# Altium project ControlBoard.PrjPcb (part 6 of 8)
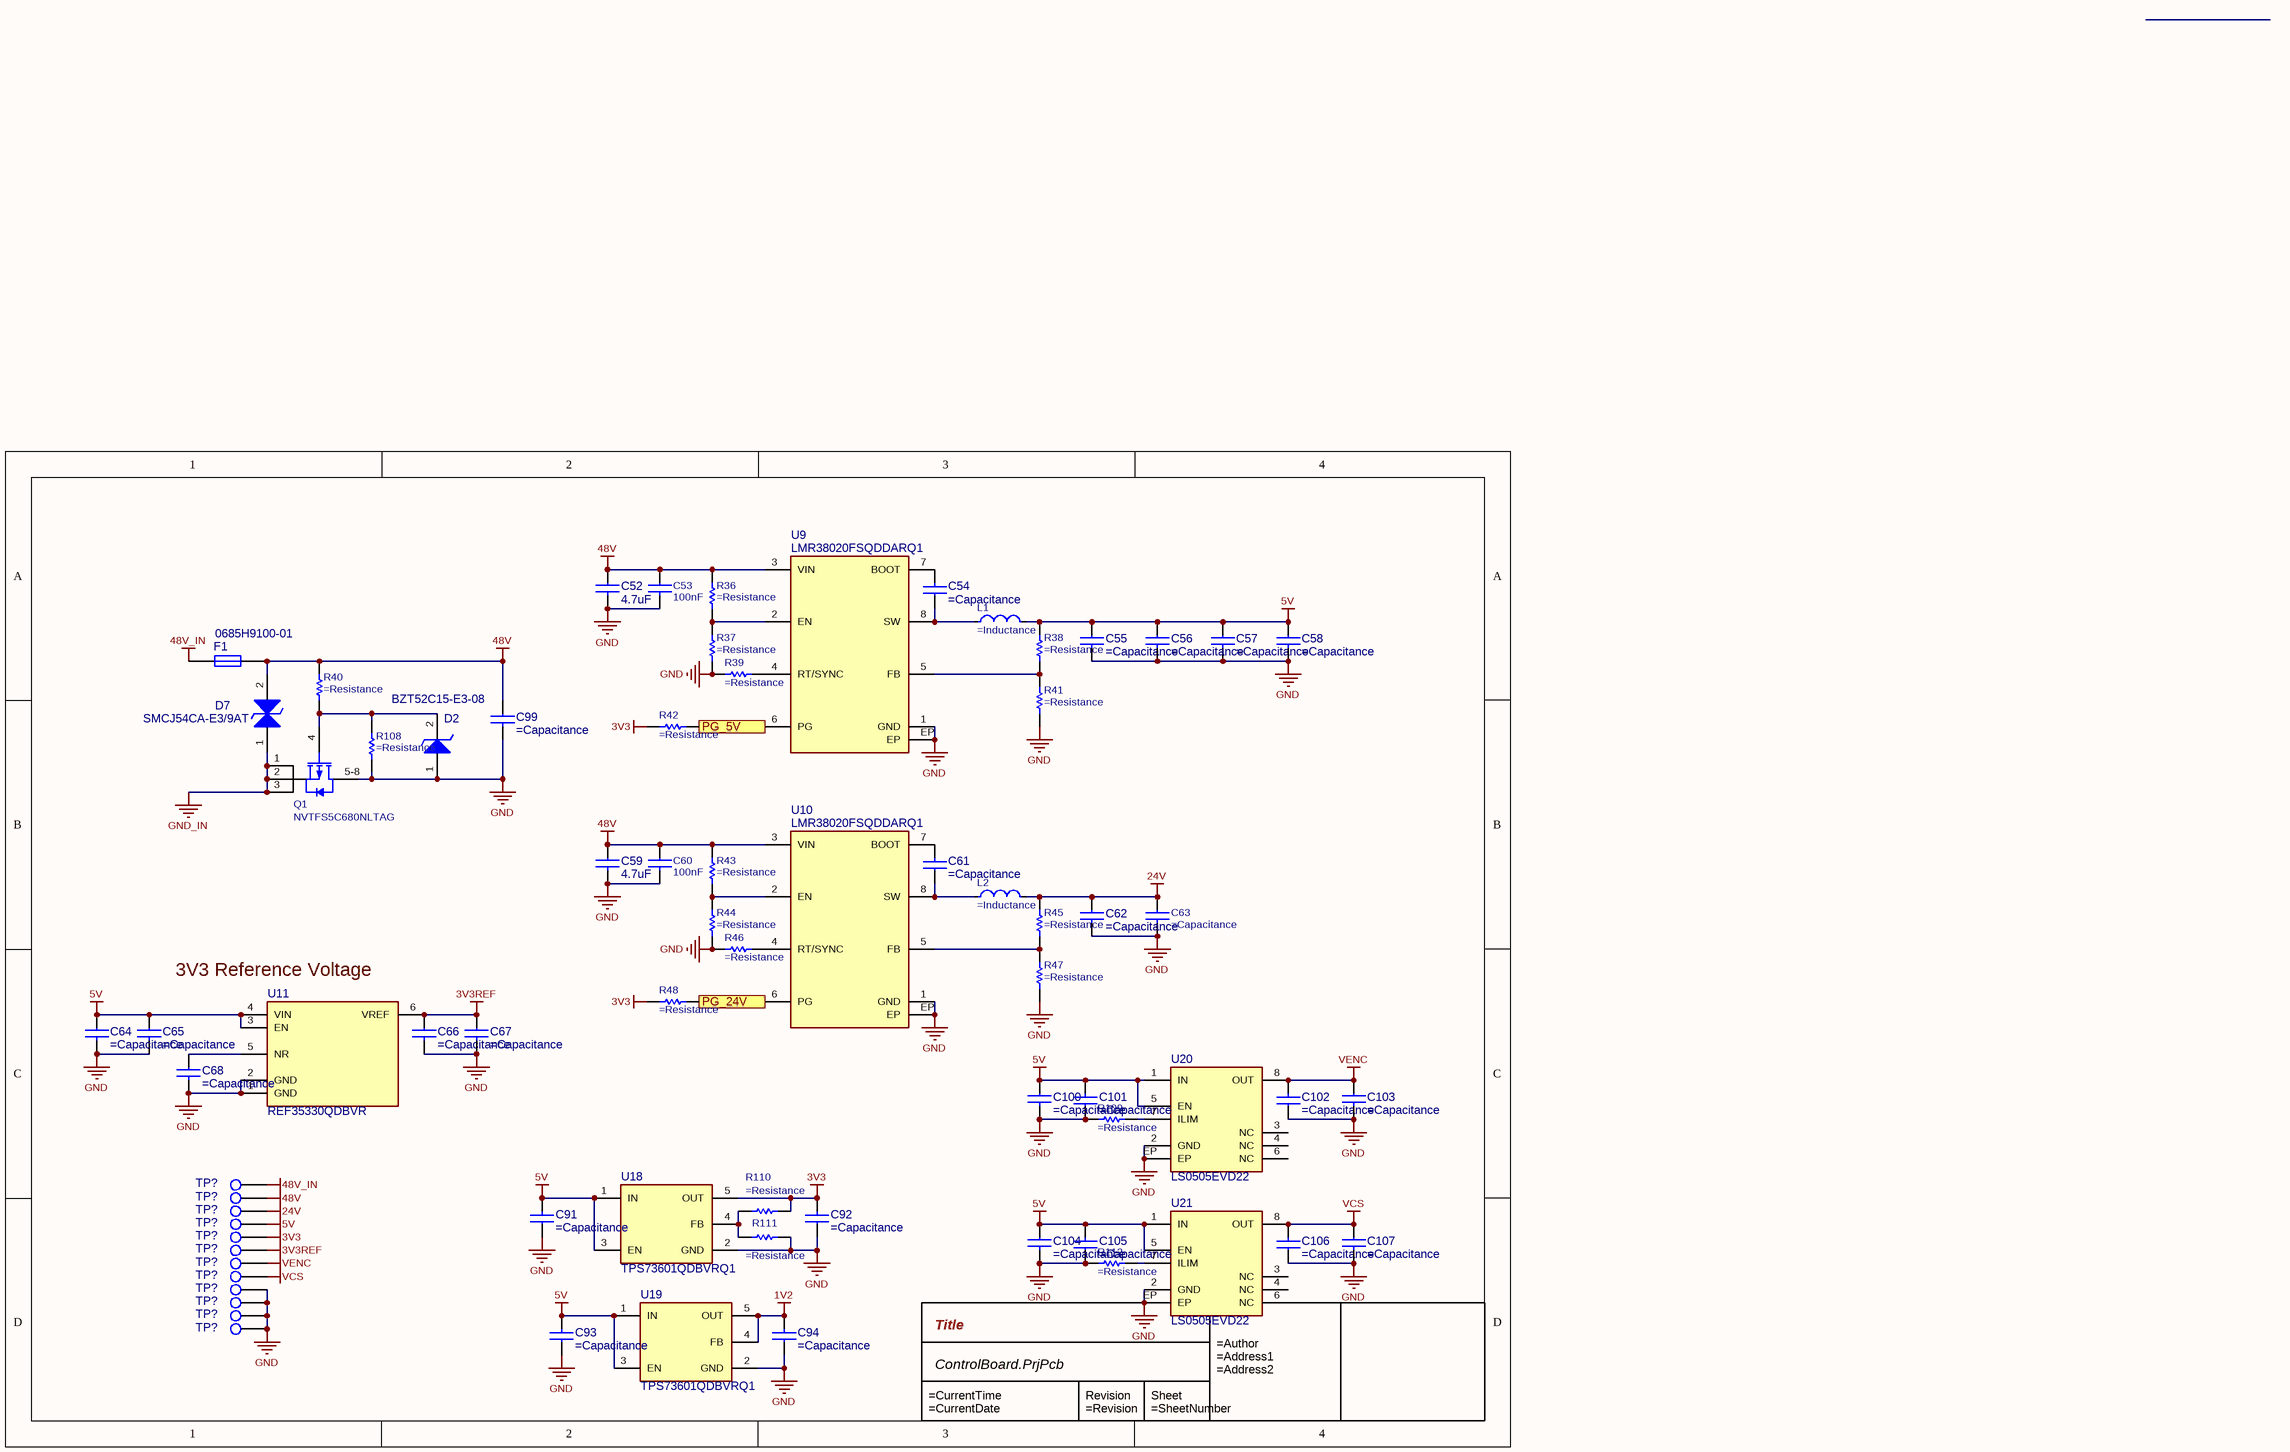
[diagram p17: Supply.SchDoc]

## Sheet Supply.SchDoc: Title (continued)
### Library data of the parts
C52 C59 = CAP1206-4.7uF-100V: Ceramic Capacitor, Multilayer, Ceramic, 100V, 10% +Tol, 10% -Tol, X7S, +-22% TC, 4.7uF, Surface Mount, 1206 inch; Manufacturer: Samsung Electro-Mechanics; Manufacturer Part Number: CL31Y475KCK6PNE; Supplier 1: DigiKey; Supplier Part Number 1: 1276-CL31Y475KCK6PNECT-ND; Supplier: DigiKey; Supplier Part Number: 1276-CL31Y475KCK6PNECT-ND; Category: Ceramic Capacitors; Stock: 182; Pricing: 1=0,85, 10=0,537, 50=0,4144, 100=0,3767, 500=0,31288, 1000=0,29316 (USD); Capacitance: 4.7uF
C53 C60 = CAP0603-0.1uF-100V: CAP CER 0.1UF 100V X7R 0603; Manufacturer: Yageo; Manufacturer Part Number: CC0603KRX7R0BB104; Material: 4241ConductorMaterial; Tolerance: 10%; Capacitance: 100nF; Supplier: Digikey; Supplier Part Number: 311-1523-1-ND; RoHS: Yes; Category: Ceramic Capacitors; Stock: 3495882; Pricing: 1=0,14, 10=0,079, 100=0,0484, 1000=0,0325 (USD); Mounting Technology: Surface Mount; Case/Package: 0603; Case Code (Metric): 1608; Case Code (Imperial): 0603; Weight: 7.1E-05oz; Min Operating Temperature: -55°C; Max Operating Temperature: 125°C; Value: 100nF; Voltage Rating: 100V; Packaging: Tape and Reel; Dielectric: X7R; Termination: SMD/SMT; Voltage Rating (DC): 100V; Package Quantity: 4000; Series: CC; Length: 0.063inch; Width: 0.031inch; Height: 900um; Thickness: 0.035inch; Lead Free: 5697LeadFree; RoHS Compliant: Yes; ComponentLink1URL: https://datasheet.ciiva.com/6277/mlccorderingcode-6277082.pdf?src-supplier=Digikey; ComponentLink1Description: https://datasheet.ciiva.com/6277/mlccorderingcode-6277082.pdf?src-supplier=Digikey; ComponentLink2URL: https://datasheet.ciiva.com/6277/mlccorderingcode-6277081.pdf?src-supplier=Digikey; ComponentLink2Description: https://datasheet.ciiva.com/6277/mlccorderingcode-6277081.pdf?src-supplier=Digikey; ComponentLink3URL: https://datasheet.ciiva.com/6277/mlccorderingcode-6277030.pdf?src-supplier=Digikey; ComponentLink3Description: https://datasheet.ciiva.com/6277/mlccorderingcode-6277030.pdf?src-supplier=Digikey; Supplier 1: Digikey; Supplier Part Number 1: 311-1523-1-ND
C54 C61 C91-C94 C101 C102 C105 C106 = CAP0402-0.1uF-50V: CAP CER 0.1UF 50V X7R 0402; Manufacturer: Walsin Technologies; Manufacturer Part Number: 0402B104K500CT; Capacitance: 100nF; Material: 4241ConductorMaterial; Value: 100nF; Tolerance: 10%; Dielectric: 1511DielectricType; Supplier: Digikey; Supplier Part Number: 1292-1176-1-ND; RoHS: Yes; Category: Ceramic Capacitors; Stock: 109567; Pricing: 1=0,08, 10=0,005, 100=0,0032, 1000=0,0024 (USD); Mounting Technology: Surface Mount; Case/Package: 0402; Case Code (Imperial): 0402; Case Code (Metric): 1005; Min Operating Temperature: -55°C; Max Operating Temperature: 125°C; Packaging: Cut Tape; Voltage Rating: 50V; Series: -; Voltage Rating (DC): 50V; Height: 550um; RoHS Compliant: Yes; Lead Free: 5697LeadFree; ComponentLink1URL: http://datasheet.octopart.com/0402B104K500CT-Walsin-Technologies-datasheet-26371553.pdf?src-supplier=Arrow+Electronics; ComponentLink1Description: http://datasheet.octopart.com/0402B104K500CT-Walsin-Technologies-datasheet-26371553.pdf?src-supplier=Arrow+Electronics; ComponentLink2URL: http://datasheet.octopart.com/0402B104K500CT-Walsin-Technologies-datasheet-26371553.pdf?src-supplier=Verical; ComponentLink2Description: http://datasheet.octopart.com/0402B104K500CT-Walsin-Technologies-datasheet-26371553.pdf?src-supplier=Verical; ComponentLink3URL: http://www.passivecomponent.com/indexsea/0402B104K500CT-IE.pdf?src-supplier=Digikey; ComponentLink3Description: http://www.passivecomponent.com/indexsea/0402B104K500CT-IE.pdf?src-supplier=Digikey; ComponentLink4URL: http://datasheet.octopart.com/0402B104K500CT-Walsin-Technologies-datasheet-26371553.pdf?src-supplier=Rs; ComponentLink4Description: http://datasheet.octopart.com/0402B104K500CT-Walsin-Technologies-datasheet-26371553.pdf?src-supplier=Rs; ComponentLink5URL: https://datasheet.octopart.com/0402B104K500CT-Walsin-Technologies-datasheet-128065749.pdf?src-supplier=Future+Electronics; ComponentLink5Description: https://datasheet.octopart.com/0402B104K500CT-Walsin-Technologies-datasheet-128065749.pdf?src-supplier=Future+Electronics; ComponentLink6URL: http://datasheet.octopart.com/0402B104K500CT-Walsin-Technologies-datasheet-26371553.pdf?src-supplier=Farnell; ComponentLink6Description: http://datasheet.octopart.com/0402B104K500CT-Walsin-Technologies-datasheet-26371553.pdf?src-supplier=Farnell; ComponentLink7URL: http://datasheet.octopart.com/0402B104K500CT-Walsin-Technologies-datasheet-26371553.pdf?src-supplier=Newark; ComponentLink7Description: http://datasheet.octopart.com/0402B104K500CT-Walsin-Technologies-datasheet-26371553.pdf?src-supplier=Newark; ComponentLink8URL: http://datasheet.octopart.com/0402B104K500CT-Walsin-Technologies-datasheet-26371553.pdf?src-supplier=Mouser; ComponentLink8Description: http://datasheet.octopart.com/0402B104K500CT-Walsin-Technologies-datasheet-26371553.pdf?src-supplier=Mouser; ComponentLink9URL: http://datasheet.octopart.com/0402B104K500CT-Walsin-Technologies-datasheet-26371553.pdf?src-supplier=Digikey; ComponentLink9Description: http://datasheet.octopart.com/0402B104K500CT-Walsin-Technologies-datasheet-26371553.pdf?src-supplier=Digikey; ComponentLink10URL: https://datasheet.octopart.com/0402B104K500CT-Walsin-Technologies-datasheet-62066062.pdf?src-supplier=TME; ComponentLink10Description: https://datasheet.octopart.com/0402B104K500CT-Walsin-Technologies-datasheet-62066062.pdf?src-supplier=TME; ComponentLink11URL: http://datasheet.octopart.com/0402B104K500CT-Walsin-Technologies-datasheet-26371553.pdf?src-supplier=Freelance+Electronics; ComponentLink11Description: http://datasheet.octopart.com/0402B104K500CT-Walsin-Technologies-datasheet-26371553.pdf?src-supplier=Freelance+Electronics; ComponentLink12URL: http://datasheet.octopart.com/0402B104K500CT-Walsin-Technologies-datasheet-26371553.pdf?src-supplier=Component+Sense; ComponentLink12Description: http://datasheet.octopart.com/0402B104K500CT-Walsin-Technologies-datasheet-26371553.pdf?src-supplier=Component+Sense; ComponentLink13URL: http://datasheet.octopart.com/0402B104K500CT-Walsin-Technologies-datasheet-26371553.pdf?src-supplier=NAC+Semi; ComponentLink13Description: http://datasheet.octopart.com/0402B104K500CT-Walsin-Technologies-datasheet-26371553.pdf?src-supplier=NAC+Semi; ComponentLink14URL: https://datasheet.octopart.com/0402B104K500CT-Walsin-Technologies-datasheet-136037192.pdf?src-supplier=TECHDesign; ComponentLink14Description: https://datasheet.octopart.com/0402B104K500CT-Walsin-Technologies-datasheet-136037192.pdf?src-supplier=TECHDesign; Supplier 1: Digikey; Supplier Part Number 1: 1292-1176-1-ND
C55 C62 C65 C66 C68 = CAP0402-0.1uF-50V: Multilayer Ceramic Capacitors MLCC - SMD/SMT 50V 1000pF C0G 0402 2%; Manufacturer: Walsin Technologies; Manufacturer Part Number: 0402B104K500CT; Capacitance: 100nF; Material: 4241ConductorMaterial; Value: 100nF; Tolerance: 10%; Dielectric: 1511DielectricType; Supplier: Digikey; Supplier Part Number: 1292-1176-1-ND; RoHS: Yes; Category: Ceramic Capacitors; Stock: 109567; Pricing: 1=0,08, 10=0,005, 100=0,0032, 1000=0,0024 (USD); Mounting Technology: Surface Mount; Case/Package: 0402; Case Code (Imperial): 0402; Case Code (Metric): 1005; Min Operating Temperature: -55°C; Max Operating Temperature: 125°C; Packaging: Cut Tape; Voltage Rating: 50V; Series: -; Voltage Rating (DC): 50V; Height: 550um; RoHS Compliant: Yes; Lead Free: 5697LeadFree; ComponentLink1URL: http://datasheet.octopart.com/0402B104K500CT-Walsin-Technologies-datasheet-26371553.pdf?src-supplier=Arrow+Electronics; ComponentLink1Description: http://datasheet.octopart.com/0402B104K500CT-Walsin-Technologies-datasheet-26371553.pdf?src-supplier=Arrow+Electronics; ComponentLink2URL: http://datasheet.octopart.com/0402B104K500CT-Walsin-Technologies-datasheet-26371553.pdf?src-supplier=Verical; ComponentLink2Description: http://datasheet.octopart.com/0402B104K500CT-Walsin-Technologies-datasheet-26371553.pdf?src-supplier=Verical; ComponentLink3URL: http://www.passivecomponent.com/indexsea/0402B104K500CT-IE.pdf?src-supplier=Digikey; ComponentLink3Description: http://www.passivecomponent.com/indexsea/0402B104K500CT-IE.pdf?src-supplier=Digikey; ComponentLink4URL: http://datasheet.octopart.com/0402B104K500CT-Walsin-Technologies-datasheet-26371553.pdf?src-supplier=Rs; ComponentLink4Description: http://datasheet.octopart.com/0402B104K500CT-Walsin-Technologies-datasheet-26371553.pdf?src-supplier=Rs; ComponentLink5URL: https://datasheet.octopart.com/0402B104K500CT-Walsin-Technologies-datasheet-128065749.pdf?src-supplier=Future+Electronics; ComponentLink5Description: https://datasheet.octopart.com/0402B104K500CT-Walsin-Technologies-datasheet-128065749.pdf?src-supplier=Future+Electronics; ComponentLink6URL: http://datasheet.octopart.com/0402B104K500CT-Walsin-Technologies-datasheet-26371553.pdf?src-supplier=Farnell; ComponentLink6Description: http://datasheet.octopart.com/0402B104K500CT-Walsin-Technologies-datasheet-26371553.pdf?src-supplier=Farnell; ComponentLink7URL: http://datasheet.octopart.com/0402B104K500CT-Walsin-Technologies-datasheet-26371553.pdf?src-supplier=Newark; ComponentLink7Description: http://datasheet.octopart.com/0402B104K500CT-Walsin-Technologies-datasheet-26371553.pdf?src-supplier=Newark; ComponentLink8URL: http://datasheet.octopart.com/0402B104K500CT-Walsin-Technologies-datasheet-26371553.pdf?src-supplier=Mouser; ComponentLink8Description: http://datasheet.octopart.com/0402B104K500CT-Walsin-Technologies-datasheet-26371553.pdf?src-supplier=Mouser; ComponentLink9URL: http://datasheet.octopart.com/0402B104K500CT-Walsin-Technologies-datasheet-26371553.pdf?src-supplier=Digikey; ComponentLink9Description: http://datasheet.octopart.com/0402B104K500CT-Walsin-Technologies-datasheet-26371553.pdf?src-supplier=Digikey; ComponentLink10URL: https://datasheet.octopart.com/0402B104K500CT-Walsin-Technologies-datasheet-62066062.pdf?src-supplier=TME; ComponentLink10Description: https://datasheet.octopart.com/0402B104K500CT-Walsin-Technologies-datasheet-62066062.pdf?src-supplier=TME; ComponentLink11URL: http://datasheet.octopart.com/0402B104K500CT-Walsin-Technologies-datasheet-26371553.pdf?src-supplier=Freelance+Electronics; ComponentLink11Description: http://datasheet.octopart.com/0402B104K500CT-Walsin-Technologies-datasheet-26371553.pdf?src-supplier=Freelance+Electronics; ComponentLink12URL: http://datasheet.octopart.com/0402B104K500CT-Walsin-Technologies-datasheet-26371553.pdf?src-supplier=Component+Sense; ComponentLink12Description: http://datasheet.octopart.com/0402B104K500CT-Walsin-Technologies-datasheet-26371553.pdf?src-supplier=Component+Sense; ComponentLink13URL: http://datasheet.octopart.com/0402B104K500CT-Walsin-Technologies-datasheet-26371553.pdf?src-supplier=NAC+Semi; ComponentLink13Description: http://datasheet.octopart.com/0402B104K500CT-Walsin-Technologies-datasheet-26371553.pdf?src-supplier=NAC+Semi; ComponentLink14URL: https://datasheet.octopart.com/0402B104K500CT-Walsin-Technologies-datasheet-136037192.pdf?src-supplier=TECHDesign; ComponentLink14Description: https://datasheet.octopart.com/0402B104K500CT-Walsin-Technologies-datasheet-136037192.pdf?src-supplier=TECHDesign; Supplier 1: Digikey; Supplier Part Number 1: 1292-1176-1-ND; China RoHS: Compliant; Depth: 500µm; Dielectric Material: Ceramic; Length: 1mm; Lifecycle Status: Production; Pins: 2; Number of Terminals: 2; REACH SVHC: Yes; Termination: SMD/SMT; Thickness: 558.8µm; Width: 500µm; ComponentLink15URL: https://datasheet.octopart.com:443/C0402C102G5GACTU-KEMET-datasheet-178132257.pdf?src-supplier=IHS; ComponentLink15Description: https://datasheet.octopart.com:443/C0402C102G5GACTU-KEMET-datasheet-178132257.pdf?src-supplier=IHS; ComponentLink16URL: https://datasheet.octopart.com:443/C0402C102G5GAC7867-KEMET-datasheet-10540709.pdf?src-supplier=IHS; ComponentLink16Description: https://datasheet.octopart.com:443/C0402C102G5GAC7867-KEMET-datasheet-10540709.pdf?src-supplier=IHS; ComponentLink17URL: https://datasheet.octopart.com:443/C0402C102G5GACTU-KEMET-datasheet-137357759.pdf?src-supplier=Upverter; ComponentLink17Description: https://datasheet.octopart.com:443/C0402C102G5GACTU-KEMET-datasheet-137357759.pdf?src-supplier=Upverter; ComponentLink18URL: https://datasheet.octopart.com:443/C0402C102G5GACTU-KEMET-datasheet-149521574.pdf?src-supplier=Farnell; ComponentLink18Description: https://datasheet.octopart.com:443/C0402C102G5GACTU-KEMET-datasheet-149521574.pdf?src-supplier=Farnell; ComponentLink19URL: https://datasheet.octopart.com:443/C0402C102G5GACTU-KEMET-datasheet-102158736.pdf?src-supplier=Newark; ComponentLink19Description: https://datasheet.octopart.com:443/C0402C102G5GACTU-KEMET-datasheet-102158736.pdf?src-supplier=Newark; ComponentLink20URL: https://datasheet.octopart.com:443/C0402C102G5GACTU-KEMET-datasheet-68331921.pdf?src-supplier=element14+APAC; ComponentLink20Description: https://datasheet.octopart.com:443/C0402C102G5GACTU-KEMET-datasheet-68331921.pdf?src-supplier=element14+APAC; ComponentLink21URL: https://datasheet.octopart.com:443/C0402C102G5GACTU-KEMET-datasheet-178087919.pdf?src-supplier=element14+APAC; ComponentLink21Description: https://datasheet.octopart.com:443/C0402C102G5GACTU-KEMET-datasheet-178087919.pdf?src-supplier=element14+APAC; ComponentLink22URL: https://datasheet.octopart.com:443/C0402C102G5GACTU-KEMET-datasheet-157246123.pdf?src-supplier=Electro+Sonic; ComponentLink22Description: https://datasheet.octopart.com:443/C0402C102G5GACTU-KEMET-datasheet-157246123.pdf?src-supplier=Electro+Sonic; ComponentLink23URL: https://datasheet.octopart.com/C0402C102G5GACTU-KEMET-datasheet-84169754.pdf; ComponentLink23Description: https://datasheet.octopart.com/C0402C102G5GACTU-KEMET-datasheet-84169754.pdf; ComponentLink24URL: https://datasheet.octopart.com:443/C0402C102G5GACTU-Kemet-datasheet-11974058.pdf?src-supplier=Arrow+Electronics; ComponentLink24Description: https://datasheet.octopart.com:443/C0402C102G5GACTU-Kemet-datasheet-11974058.pdf?src-supplier=Arrow+Electronics
C56-C58 = CAP0402-22uF-10V: Ceramic Capacitor, Multilayer, Ceramic, 10V, 20% +Tol, 20% -Tol, X6S, 22uF, Surface Mount, 0603; Manufacturer: Murata; Manufacturer Part Number: GRM188C81A226ME01D; Capacitance: 22µF; Value: 22µF; Supplier 1: DigiKey; Supplier Part Number 1: 490-GRM188C81A226ME01DTR-ND; Supplier: DigiKey; Supplier Part Number: 490-GRM188C81A226ME01DTR-ND; RoHS: Compliant; Category: Ceramic Capacitors; Pricing: 4000=0,07397 (USD); Case/Package: 0603; Dielectric: X6S; Dielectric Material: Ceramic; Height: 800µm; Length: 1.6mm; Lifecycle Status: Production; Material: Ceramic; Max Operating Temperature: 105°C; Min Operating Temperature: -55°C; Mounting Technology: Surface Mount; Number of Terminals: 2; REACH SVHC: Yes; Thickness: 800µm; Tolerance: 20%; Voltage Rating: 10V; Voltage Rating (DC): 10V; Width: 800µm; ComponentLink1URL: https://datasheet.octopart.com:443/GRM188C81A226ME01D-Murata-datasheet-165579666.pdf?src-supplier=TME; ComponentLink1Description: https://datasheet.octopart.com:443/GRM188C81A226ME01D-Murata-datasheet-165579666.pdf?src-supplier=TME; ComponentLink2URL: https://datasheet.octopart.com/GRM188C81A226ME01D-Murata-datasheet-12515295.pdf; ComponentLink2Description: https://datasheet.octopart.com/GRM188C81A226ME01D-Murata-datasheet-12515295.pdf; ComponentLink3URL: https://datasheet.octopart.com/GRM188C81A226ME01D-Murata-datasheet-12510076.pdf; ComponentLink3Description: https://datasheet.octopart.com/GRM188C81A226ME01D-Murata-datasheet-12510076.pdf; ComponentLink4URL: https://datasheet.octopart.com/GRM188C81A226ME01D-Murata-datasheet-11978611.pdf; ComponentLink4Description: https://datasheet.octopart.com/GRM188C81A226ME01D-Murata-datasheet-11978611.pdf; ComponentLink5URL: https://datasheet.octopart.com/GRM188C81A226ME01D-Murata-datasheet-10025737.pdf; ComponentLink5Description: https://datasheet.octopart.com/GRM188C81A226ME01D-Murata-datasheet-10025737.pdf; ComponentLink6URL: https://datasheet.octopart.com/GRM188C81A226ME01D-Murata-datasheet-8819587.pdf; ComponentLink6Description: https://datasheet.octopart.com/GRM188C81A226ME01D-Murata-datasheet-8819587.pdf; ComponentLink7URL: http://sigma.octopart.com:80/reach_statement/Murata-company-16.pdf?src-supplier=Compliance+Statements; ComponentLink7Description: http://sigma.octopart.com:80/reach_statement/Murata-company-16.pdf?src-supplier=Compliance+Statements
C63 = CAP0805-33uF-10V: CAP CER 22UF 50V X5R SMD; Manufacturer: TDK; Manufacturer Part Number: C2012X5R1A336M125AC; Capacitance: 33uF; Dielectric Material: Ceramic; Material: 4241ConductorMaterial; Value: 33uF; Voltage Rating: 10V; Tolerance: 20%; Supplier: Digikey; Supplier Part Number: 445-8238-1-ND; RoHS: Yes; Category: Ceramic Capacitors; Stock: 98304; Pricing: 1=0,89, 10=0,565, 100=0,3979, 1000=0,31083 (USD); Mounting Technology: Surface Mount; Case/Package: 0805; Case Code (Metric): 2012; Case Code (Imperial): 0805; Weight: 0.000194oz; Min Operating Temperature: -55°C; Max Operating Temperature: 85°C; Packaging: Tape and Reel; Series: C; Package Quantity: 1; Voltage Rating (DC): 10V; Termination: SMD/SMT; Dielectric: X5R; Length: 2mm; Width: 0.049inch; Height: 1.25mm; Depth: 1.25mm; Thickness: 0.057inch; RoHS Compliant: Yes; Lead Free: Lead Free; Reach SVHC Compliant: No; ComponentLink1URL: https://datasheet.ciiva.com/24216/c2012x5r1a336m125ac-264804-24216541.pdf?src-supplier=Mouser; ComponentLink1Description: https://datasheet.ciiva.com/24216/c2012x5r1a336m125ac-264804-24216541.pdf?src-supplier=Mouser; ComponentLink2URL: https://datasheet.ciiva.com/6259/tdkmlcccaprange-6259263.pdf?src-supplier=Digikey; ComponentLink2Description: https://datasheet.ciiva.com/6259/tdkmlcccaprange-6259263.pdf?src-supplier=Digikey; Supplier 1: Digikey; Supplier Part Number 1: 445-1655-1-ND
C64 C67 = CAP0402-4.7uF-10V: Ceramic Capacitor, Ceramic, 10V, 10% +Tol, 10% -Tol, X5R, 15% TC, 4.7uF, Surface Mount, 0402; Manufacturer: Yageo Group; Manufacturer Part Number: CC0402KRX5R6BB475; Capacitance: 4.7µF; Value: 4.7µF; Temperature Coefficient: 30ppm/°C; Supplier 1: DigiKey; Supplier Part Number 1: 13-CC0402KRX5R6BB475DKR-ND; Supplier: DigiKey; Supplier Part Number: 13-CC0402KRX5R6BB475DKR-ND; RoHS: Compliant; Category: Ceramic Capacitors; Pricing: 1=0,11, 10=0,063, 50=0,0438, 100=0,038, 500=0,02808, 1000=0,02628, 2500=0,02393, 5000=0,02325 (USD); Case/Package: 0402; China RoHS: Compliant; Dielectric: X5R; Dielectric Material: Ceramic; Halogen Free: Halogen Free; Height: 500µm; Lead Free: Lead Free; Length: 1mm; Lifecycle Status: Production; Material: Ceramic; Max Operating Temperature: 85°C; Min Operating Temperature: -55°C; Mounting Technology: Surface Mount; Number of Terminals: 2; REACH SVHC: Yes; Voltage Rating: 10V; Voltage Rating (DC): 10V; Width: 500µm; ComponentLink1URL: https://datasheet.octopart.com:443/CC0402KRX5R6BB475-Yageo-datasheet-170350636.pdf?src-supplier=Future+Electronics; ComponentLink1Description: https://datasheet.octopart.com:443/CC0402KRX5R6BB475-Yageo-datasheet-170350636.pdf?src-supplier=Future+Electronics; ComponentLink2URL: https://datasheet.octopart.com:443/CC0402KRX5R6BB475-Yageo-datasheet-82528541.pdf?src-supplier=Future+Electronics; ComponentLink2Description: https://datasheet.octopart.com:443/CC0402KRX5R6BB475-Yageo-datasheet-82528541.pdf?src-supplier=Future+Electronics; ComponentLink3URL: https://datasheet.octopart.com:443/CC0402KRX5R6BB475-Yageo-datasheet-78855684.pdf?src-supplier=Upverter; ComponentLink3Description: https://datasheet.octopart.com:443/CC0402KRX5R6BB475-Yageo-datasheet-78855684.pdf?src-supplier=Upverter; ComponentLink4URL: https://datasheet.octopart.com:443/CC0402KRX5R6BB475-Yageo-Group-datasheet-189192896.pdf?src-supplier=TME; ComponentLink4Description: https://datasheet.octopart.com:443/CC0402KRX5R6BB475-Yageo-Group-datasheet-189192896.pdf?src-supplier=TME; ComponentLink5URL: https://datasheet.octopart.com:443/CC0402KRX5R6BB475-Yageo-datasheet-182029407.pdf?src-supplier=Newark; ComponentLink5Description: https://datasheet.octopart.com:443/CC0402KRX5R6BB475-Yageo-datasheet-182029407.pdf?src-supplier=Newark; ComponentLink6URL: https://datasheet.octopart.com:443/CC0402KRX5R6BB475-Yageo-datasheet-158238148.pdf?src-supplier=Newark; ComponentLink6Description: https://datasheet.octopart.com:443/CC0402KRX5R6BB475-Yageo-datasheet-158238148.pdf?src-supplier=Newark; ComponentLink7URL: https://datasheet.octopart.com:443/CC0402KRX5R6BB475-Yageo-Group-datasheet-145016144.pdf?src-supplier=ODG+(Origin+Data+Global); ComponentLink7Description: https://datasheet.octopart.com:443/CC0402KRX5R6BB475-Yageo-Group-datasheet-145016144.pdf?src-supplier=ODG+(Origin+Data+Global); ComponentLink8URL: https://datasheet.octopart.com/CC0402KRX5R6BB475-Yageo-datasheet-86397281.pdf; ComponentLink8Description: https://datasheet.octopart.com/CC0402KRX5R6BB475-Yageo-datasheet-86397281.pdf; ComponentLink9URL: http://sigma.octopart.com:80/rohs_statement/Yageo-company-2.pdf?src-supplier=Compliance+Statements; ComponentLink9Description: http://sigma.octopart.com:80/rohs_statement/Yageo-company-2.pdf?src-supplier=Compliance+Statements; ComponentLink10URL: http://sigma.octopart.com:80/conflict_mineral_statement/Yageo-company-3.pdf?src-supplier=Compliance+Statements; ComponentLink10Description: http://sigma.octopart.com:80/conflict_mineral_statement/Yageo-company-3.pdf?src-supplier=Compliance+Statements
C99 = CAP2220-22uF-100V: 100V 22uF X7S 卤20% 2220 Multilayer Ceramic Capacitors MLCC - SMD/SMT ROHS; Manufacturer: TDK; Manufacturer Part Number: C5750X7S2A226M280KB; Manufacturer Lifecycle Status: PRODUCTION; Capacitance: 22µF; Value: 22µF; Supplier 1: DigiKey; Supplier Part Number 1: 445-C5750X7S2A226M280KBCT-ND; Supplier: DigiKey; Supplier Part Number: 445-C5750X7S2A226M280KBCT-ND; RoHS: Compliant; Category: Ceramic Capacitors; Stock: 105682; Pricing: 1=5,31, 10=3,608, 50=3,2764, 100=3,0974 (USD); Case/Package: 2220; China RoHS: Compliant; Dielectric Material: Ceramic; Height: 2.8mm; Length: 5.7mm; Lifecycle Status: Production; Material: Ceramic; Max Length: 6.1mm; Max Operating Temperature: 125°C; Max Width: 5.4mm; Min Length: 5.3mm; Min Operating Temperature: -55°C; Min Width: 4.6mm; Mounting Technology: Surface Mount; Number of Terminals: 2; REACH SVHC: Yes; Schedule B: 8532240020, 8532240020|8532240020|8532240020|8532240020|8532240020; Voltage Rating: 100V; Voltage Rating (DC): 100V; Width: 5mm; ComponentLink1URL: https://datasheet.octopart.com:443/C5750X7S2A226M280KB-TDK-datasheet-159617022.pdf?src-supplier=IHS; ComponentLink1Description: https://datasheet.octopart.com:443/C5750X7S2A226M280KB-TDK-datasheet-159617022.pdf?src-supplier=IHS; ComponentLink2URL: https://datasheet.octopart.com:443/C5750X7S2A226M280KB-TDK-datasheet-151546522.pdf?src-supplier=TDK; ComponentLink2Description: https://datasheet.octopart.com:443/C5750X7S2A226M280KB-TDK-datasheet-151546522.pdf?src-supplier=TDK; ComponentLink3URL: https://datasheet.octopart.com:443/C5750X7S2A226M280KB-TDK-datasheet-43914167.pdf?src-supplier=Future+Electronics; ComponentLink3Description: https://datasheet.octopart.com:443/C5750X7S2A226M280KB-TDK-datasheet-43914167.pdf?src-supplier=Future+Electronics; ComponentLink4URL: https://datasheet.octopart.com:443/C5750X7S2A226M280KB-TDK-datasheet-182135025.pdf?src-supplier=TME; ComponentLink4Description: https://datasheet.octopart.com:443/C5750X7S2A226M280KB-TDK-datasheet-182135025.pdf?src-supplier=TME
C100 C103 C104 C107 = CAP0402-1uF-25V: Multilayer Ceramic Capacitors MLCC - SMD/SMT 0402 1uF 25volts *Derate Voltage/Temp; Manufacturer: Murata; Manufacturer Part Number: GRM155C81E105KE11J; Manufacturer Lifecycle Status: IN PRODUCTION; Capacitance: 1µF; Value: 1µF; Dielectric: X6S; Tolerance: 10%; Voltage Rating: 25V; Supplier 1: DigiKey; Supplier Part Number 1: 490-GRM155C81E105KE11JCT-ND; Supplier: DigiKey; Supplier Part Number: 490-GRM155C81E105KE11JCT-ND; RoHS: Compliant; Category: Ceramic Capacitors; Stock: 78531; Pricing: 1=0,1, 10=0,043, 50=0,0294, 100=0,0253, 500=0,01832, 1000=0,01619, 2500=0,01394, 5000=0,01258 (USD); Case/Package: 0402; Case Code (Imperial): 0402; Case Code (Metric): 1005; Dielectric Material: Ceramic; Height: 500µm; Length: 1mm; Lifecycle Status: Production; Material: Ceramic; Max Operating Temperature: 105°C; Min Operating Temperature: -55°C; Mounting Technology: Surface Mount; Number of Terminals: 2; Packaging: Tape & Reel (TR); REACH SVHC: Yes; Termination: SMD/SMT; Thickness: 500µm; Voltage Rating (DC): 25V; Weight: 6.010099mg; Width: 500µm; ComponentLink1URL: https://datasheet.octopart.com:443/GRM155C81E105KE11J-Murata-datasheet-165579666.pdf?src-supplier=TME; ComponentLink1Description: https://datasheet.octopart.com:443/GRM155C81E105KE11J-Murata-datasheet-165579666.pdf?src-supplier=TME; ComponentLink2URL: https://datasheet.octopart.com:443/GRM155C81E105KE11J-Murata-datasheet-141266224.pdf?src-supplier=Ciiva; ComponentLink2Description: https://datasheet.octopart.com:443/GRM155C81E105KE11J-Murata-datasheet-141266224.pdf?src-supplier=Ciiva; ComponentLink3URL: https://datasheet.octopart.com:443/GRM155C81E105KE11J-Murata-datasheet-140688500.pdf?src-supplier=Ciiva; ComponentLink3Description: https://datasheet.octopart.com:443/GRM155C81E105KE11J-Murata-datasheet-140688500.pdf?src-supplier=Ciiva; ComponentLink4URL: https://datasheet.octopart.com:443/GRM155C81E105KE11J-Murata-datasheet-138740527.pdf?src-supplier=Ciiva; ComponentLink4Description: https://datasheet.octopart.com:443/GRM155C81E105KE11J-Murata-datasheet-138740527.pdf?src-supplier=Ciiva; ComponentLink5URL: https://datasheet.octopart.com:443/GRM155C81E105KE11J-Murata-datasheet-149522958.pdf?src-supplier=Farnell; ComponentLink5Description: https://datasheet.octopart.com:443/GRM155C81E105KE11J-Murata-datasheet-149522958.pdf?src-supplier=Farnell; ComponentLink6URL: https://datasheet.octopart.com/GRM155C81E105KE11J-Murata-datasheet-12515295.pdf; ComponentLink6Description: https://datasheet.octopart.com/GRM155C81E105KE11J-Murata-datasheet-12515295.pdf; ComponentLink7URL: https://datasheet.octopart.com/GRM155C81E105KE11J-Murata-datasheet-12510076.pdf; ComponentLink7Description: https://datasheet.octopart.com/GRM155C81E105KE11J-Murata-datasheet-12510076.pdf; ComponentLink8URL: https://datasheet.octopart.com/GRM155C81E105KE11J-Murata-datasheet-11978611.pdf; ComponentLink8Description: https://datasheet.octopart.com/GRM155C81E105KE11J-Murata-datasheet-11978611.pdf; ComponentLink9URL: https://datasheet.octopart.com/GRM155C81E105KE11J-Murata-datasheet-10025737.pdf; ComponentLink9Description: https://datasheet.octopart.com/GRM155C81E105KE11J-Murata-datasheet-10025737.pdf; ComponentLink10URL: https://datasheet.octopart.com/GRM155C81E105KE11J-Murata-datasheet-8819587.pdf; ComponentLink10Description: https://datasheet.octopart.com/GRM155C81E105KE11J-Murata-datasheet-8819587.pdf; ComponentLink11URL: https://datasheet.octopart.com/GRM155C81E105KE11J-Murata-datasheet-38882740.pdf; ComponentLink11Description: https://datasheet.octopart.com/GRM155C81E105KE11J-Murata-datasheet-38882740.pdf; ComponentLink12URL: http://sigma.octopart.com:80/reach_statement/Murata-company-16.pdf?src-supplier=Compliance+Statements; ComponentLink12Description: http://sigma.octopart.com:80/reach_statement/Murata-company-16.pdf?src-supplier=Compliance+Statements
D2 = BZT52C15-E3-08: DIODE ZENER 15V 410MW SOD123; Manufacturer: Vishay; Supplier: Digikey; Supplier Part Number: BZT52C15-E3-08GICT-ND; Manufacturer Part Number: BZT52C15-E3-08; RoHS: Yes; Category: Zener Diodes; Stock: 18922; Pricing: 1=0,15, 10=0,104, 100=0,047, 500=0,0465, 1000=0,046 (USD); ComponentLink1URL: http://www.mouser.com/ds/2/427/bzt52-106265.pdf?src-supplier=Mouser; ComponentLink1Description: http://www.mouser.com/ds/2/427/bzt52-106265.pdf?src-supplier=Mouser; ComponentLink2URL: http://www.farnell.com/datasheets/2046168.pdf?src-supplier=Farnell; ComponentLink2Description: http://www.farnell.com/datasheets/2046168.pdf?src-supplier=Farnell; ComponentLink3URL: http://www.vishay.com/docs/85760/bzt52.pdf?src-supplier=Digikey; ComponentLink3Description: http://www.vishay.com/docs/85760/bzt52.pdf?src-supplier=Digikey; ComponentLink4URL: https://www.vishay.com/docs/85760/bzt52.pdf?src-supplier=Digikey; ComponentLink4Description: https://www.vishay.com/docs/85760/bzt52.pdf?src-supplier=Digikey; ComponentLink5URL: http://www.vishay.com/docs/85760/bzt52.pdf?src-supplier=Avnet; ComponentLink5Description: http://www.vishay.com/docs/85760/bzt52.pdf?src-supplier=Avnet; ComponentLink6URL: http://www.farnell.com/datasheets/2046168.pdf?src-supplier=Element14; ComponentLink6Description: http://www.farnell.com/datasheets/2046168.pdf?src-supplier=Element14; ComponentLink7URL: https://datasheet.octopart.com/BZT52C15-E3-08-Vishay-datasheet-32036674.pdf?src-supplier=Newark; ComponentLink7Description: https://datasheet.octopart.com/BZT52C15-E3-08-Vishay-datasheet-32036674.pdf?src-supplier=Newark; ComponentLink8URL: http://www.farnell.com/datasheets/1852933.pdf?src-supplier=Newark; ComponentLink8Description: http://www.farnell.com/datasheets/1852933.pdf?src-supplier=Newark; Supplier 1: Digikey; Supplier Part Number 1: BZT52C15-E3-08GICT-ND
D7 = SMCJ54CA: Trans Voltage Suppressor Diode, 1500W, 54V V(RWM), Bidirectional, 1 Element, Silicon, DO-214AB; Manufacturer: Vishay; Breakdown Voltage: 63.15V; Clamping Voltage: 87.1V; Element Configuration: Single; Leakage Current: 1µA; Max Breakdown Voltage: 66.3V; Max Junction Temperature (Tj): 150°C; Max Power Dissipation: 6.5W; Max Surge Current: 200A; Min Breakdown Voltage: 60V; Number of Bidirectional Channels: 1; Peak Pulse Current: 17.2A; Peak Pulse Power: 1.5kW; Power Line Protection: No; Test Current: 1mA; Supplier 1: DigiKey; Supplier Part Number 1: SMCJ54CA-E3/9AT-ND; Supplier: DigiKey; Supplier Part Number: SMCJ54CA-E3/9AT-ND; Manufacturer Part Number: SMCJ54CA-E3/9AT; RoHS: Compliant; Category: TVS Diodes; Pricing: 3500=0,181, 24500=0,1805 (USD); Case/Package: SMC; China RoHS: Non-Compliant; Composition: Zener; Direction: Bidirectional; Height: 2.62mm; Lifecycle Status: Production; Max Operating Temperature: 150°C; Max Reverse Leakage Current: 1µA; Min Operating Temperature: -55°C; Mounting Technology: Surface Mount; Number of Channels: 1; Number of Elements: 1; Pins: 2; Number of Terminals: 2; Operating Supply Voltage: 54V; Polarity: Bidirectional; REACH SVHC: No; Reverse Breakdown Voltage: 60V; Reverse Standoff Voltage: 54V; ComponentLink1URL: https://datasheet.octopart.com:443/SMCJ54CA-E3-9AT-Vishay-datasheet-164762082.pdf?src-supplier=IHS; ComponentLink1Description: https://datasheet.octopart.com:443/SMCJ54CA-E3-9AT-Vishay-datasheet-164762082.pdf?src-supplier=IHS; ComponentLink2URL: https://datasheet.octopart.com:443/SMCJ54CA-E3-9AT-Vishay-Semiconductor-datasheet-138899015.pdf?src-supplier=Upverter; ComponentLink2Description: https://datasheet.octopart.com:443/SMCJ54CA-E3-9AT-Vishay-Semiconductor-datasheet-138899015.pdf?src-supplier=Upverter; ComponentLink3URL: https://sigma.octopart.com:443/138898641/technical_drawing/Vishay-Semiconductor-SMCJ54CA-E3-9AT.pdf?src-supplier=Upverter; ComponentLink3Description: https://sigma.octopart.com:443/138898641/technical_drawing/Vishay-Semiconductor-SMCJ54CA-E3-9AT.pdf?src-supplier=Upverter; ComponentLink4URL: https://datasheet.octopart.com:443/SMCJ54CA-E3/9AT-Vishay-datasheet-11546720.pdf?src-supplier=Arrow+Electronics; ComponentLink4Description: https://datasheet.octopart.com:443/SMCJ54CA-E3/9AT-Vishay-datasheet-11546720.pdf?src-supplier=Arrow+Electronics; ComponentLink5URL: http://sigma.octopart.com:80/rohs_statement/Vishay-company-15.pdf?src-supplier=Compliance+Statements; ComponentLink5Description: http://sigma.octopart.com:80/rohs_statement/Vishay-company-15.pdf?src-supplier=Compliance+Statements
F1 = 0685H9100-01: Fuse Chip Fast Acting 10A 125V SMD Solder Pad 1206 3.2 X 1.58 X 0.65mm Ceramic; Manufacturer: Bel Fuse; Time to Trip: 5s; Voltage Rating (DC): 32V; Supplier 1: DigiKey; Supplier Part Number 1: 5923-0685H9100-01CT-ND; Supplier: DigiKey; Supplier Part Number: 5923-0685H9100-01CT-ND; Manufacturer Part Number: 0685H9100-01; RoHS: Compliant; Category: Fuses; Stock: 123363; Pricing: 1=0,36, 5=0,302, 10=0,278, 50=0,2308, 100=0,213, 250=0,19152, 500=0,17666, 1000=0,16294 (USD); China RoHS: Compliant; Current Rating: 10A; Height: 650µm; Length: 3.2mm; Lifecycle Status: Production; Max Operating Temperature: 125°C; Min Operating Temperature: -55°C; Mounting Technology: Surface Mount; REACH SVHC: Yes; Schedule B: 8536100040, 8536100040|8536100040|8536100040|8536100040|8536100040; Voltage Rating (AC): 125V; ComponentLink1URL: https://datasheet.octopart.com:443/0685H9100-01-Bel-Fuse-datasheet-137317061.pdf?src-supplier=IHS; ComponentLink1Description: https://datasheet.octopart.com:443/0685H9100-01-Bel-Fuse-datasheet-137317061.pdf?src-supplier=IHS; ComponentLink2URL: https://datasheet.octopart.com:443/0685H9100-01-Bel-Fuse-datasheet-104408181.pdf?src-supplier=element14+APAC; ComponentLink2Description: https://datasheet.octopart.com:443/0685H9100-01-Bel-Fuse-datasheet-104408181.pdf?src-supplier=element14+APAC
L1 = ETQP4M150KFM: Power Inductor, 15Uh, Shielded, 7.2A Rohs Compliant: Yes |Panasonic ETQP4M150KFM; DC Resistance (DCR): 66.77mΩ; Value: 15µH; Max Current Rating: 4.6A; Number of Circuits: 1; Test Frequency: 100kHz; Tolerance: 20%; Supplier 1: DigiKey; Supplier Part Number 1: 10-ETQ-P4M150KFMCT-ND; Supplier: DigiKey; Supplier Part Number: 10-ETQ-P4M150KFMCT-ND; Manufacturer: Panasonic; Manufacturer Part Number: ETQP4M150KFM; RoHS: Compliant; Category: Fixed Inductors; Stock: 1970; Pricing: 1=0,76, 10=0,623, 25=0,5768, 50=0,5438, 100=0,5126, 250=0,47424 (USD); Height: 4.8mm; Lifecycle Status: Production; Max Operating Temperature: 150°C; Min Operating Temperature: -40°C; Number of Terminals: 2; REACH SVHC: Yes; Shielding: Yes; Width: 7mm; ComponentLink1URL: https://datasheet.octopart.com:443/ETQP4M150KFM-Panasonic-datasheet-180975443.pdf?src-supplier=IHS; ComponentLink1Description: https://datasheet.octopart.com:443/ETQP4M150KFM-Panasonic-datasheet-180975443.pdf?src-supplier=IHS; Inductance: 15µH
L2 = ETQP5M470YFM: Power Choke Shielded Wirewound 48uH 20% 100KHz Metal 2.9A 0.172Ohm DCR Automotive T/R; Manufacturer: Panasonic; Core Material: Composite, Metal; Current: 19A; DC Resistance (DCR): 172mΩ; Value: 48µH; Max DC Current: 1A; Number of Circuits: 1; RMS Current (Irms): 2.3A; Saturation Current: 4.1A; Shielding: Yes; Supplier 1: DigiKey; Supplier Part Number 1: PCD2319CT-ND; Supplier: DigiKey; Supplier Part Number: PCD2319CT-ND; Manufacturer Part Number: ETQP5M470YFM; RoHS: Compliant; Category: Fixed Inductors; Pricing: 1=1,06, 10=0,872, 25=0,8068, 50=0,7606, 100=0,7171, 250=0,66348 (USD); Case/Package: Metal; Depth: 7.9mm; Height: 5.4mm; Inductance Tolerance: 20%; Lead Free: Lead Free; Length: 7.5mm; Lifecycle Status: Production; Max Current Rating: 2.9A; Max Operating Temperature: 150°C; Military Standard: Not; Min Operating Temperature: -40°C; Mounting Technology: Surface Mount; Pins: 2; Number of Terminals: 2; Radiation Hardening: No; REACH SVHC: Yes; Schedule B: 8504500000; ESR: 172mΩ; Termination: SMD/SMT; Test Frequency: 100kHz; Tolerance: 20%; Width: 7mm; ComponentLink1URL: https://datasheet.octopart.com:443/ETQP5M470YFM-Panasonic-datasheet-180975438.pdf?src-supplier=IHS; ComponentLink1Description: https://datasheet.octopart.com:443/ETQP5M470YFM-Panasonic-datasheet-180975438.pdf?src-supplier=IHS; ComponentLink2URL: https://datasheet.octopart.com:443/ETQP5M470YFM-Panasonic-datasheet-97125960.pdf?src-supplier=Upverter; ComponentLink2Description: https://datasheet.octopart.com:443/ETQP5M470YFM-Panasonic-datasheet-97125960.pdf?src-supplier=Upverter; ComponentLink3URL: https://datasheet.octopart.com:443/ETQP5M470YFM-Panasonic-datasheet-8818269.pdf?src-supplier=element14+APAC; ComponentLink3Description: https://datasheet.octopart.com:443/ETQP5M470YFM-Panasonic-datasheet-8818269.pdf?src-supplier=element14+APAC; ComponentLink4URL: https://datasheet.octopart.com:443/ETQP5M470YFM-Panasonic-datasheet-136612417.pdf?src-supplier=Newark; ComponentLink4Description: https://datasheet.octopart.com:443/ETQP5M470YFM-Panasonic-datasheet-136612417.pdf?src-supplier=Newark; ComponentLink5URL: https://datasheet.octopart.com:443/ETQP5M470YFM-Panasonic-datasheet-10622521.pdf?src-supplier=Newark; ComponentLink5Description: https://datasheet.octopart.com:443/ETQP5M470YFM-Panasonic-datasheet-10622521.pdf?src-supplier=Newark; ComponentLink6URL: https://datasheet.octopart.com:443/ETQP5M470YFM-Panasonic-datasheet-81843036.pdf?src-supplier=Newark; ComponentLink6Description: https://datasheet.octopart.com:443/ETQP5M470YFM-Panasonic-datasheet-81843036.pdf?src-supplier=Newark; ComponentLink7URL: https://datasheet.octopart.com:443/ETQ-P5M470YFM-Panasonic-datasheet-78862187.pdf?src-supplier=Newark; ComponentLink7Description: https://datasheet.octopart.com:443/ETQ-P5M470YFM-Panasonic-datasheet-78862187.pdf?src-supplier=Newark; ComponentLink8URL: https://datasheet.octopart.com:443/ETQP5M470YFM-Panasonic-datasheet-103789982.pdf?src-supplier=Farnell; ComponentLink8Description: https://datasheet.octopart.com:443/ETQP5M470YFM-Panasonic-datasheet-103789982.pdf?src-supplier=Farnell; ComponentLink9URL: https://datasheet.octopart.com:443/ETQP5M470YFM-Panasonic-datasheet-13535884.pdf?src-supplier=Farnell; ComponentLink9Description: https://datasheet.octopart.com:443/ETQP5M470YFM-Panasonic-datasheet-13535884.pdf?src-supplier=Farnell; ComponentLink10URL: https://datasheet.octopart.com:443/ETQ-P5M470YFM-Panasonic-datasheet-154766191.pdf?src-supplier=Master+Electronics; ComponentLink10Description: https://datasheet.octopart.com:443/ETQ-P5M470YFM-Panasonic-datasheet-154766191.pdf?src-supplier=Master+Electronics; ComponentLink11URL: https://datasheet.octopart.com:443/ETQ-P5M470YFM-Panasonic-datasheet-140363995.pdf?src-supplier=Master+Electronics; ComponentLink11Description: https://datasheet.octopart.com:443/ETQ-P5M470YFM-Panasonic-datasheet-140363995.pdf?src-supplier=Master+Electronics; ComponentLink12URL: https://datasheet.octopart.com:443/ETQ-P5M470YFM-Panasonic-datasheet-8835794.pdf?src-supplier=Factory+Futures; ComponentLink12Description: https://datasheet.octopart.com:443/ETQ-P5M470YFM-Panasonic-datasheet-8835794.pdf?src-supplier=Factory+Futures; ComponentLink13URL: https://datasheet.octopart.com:443/ETQP5M470YFM-Panasonic-datasheet-7823580.pdf?src-supplier=element14; ComponentLink13Description: https://datasheet.octopart.com:443/ETQP5M470YFM-Panasonic-datasheet-7823580.pdf?src-supplier=element14; ComponentLink14URL: https://datasheet.octopart.com:443/ETQP5M470YFM-Panasonic-datasheet-61114973.pdf?src-supplier=Future+Electronics; ComponentLink14Description: https://datasheet.octopart.com:443/ETQP5M470YFM-Panasonic-datasheet-61114973.pdf?src-supplier=Future+Electronics; ComponentLink15URL: https://datasheet.octopart.com:443/ETQP5M470YFM-Panasonic-datasheet-156876476.pdf?src-supplier=TME; ComponentLink15Description: https://datasheet.octopart.com:443/ETQP5M470YFM-Panasonic-datasheet-156876476.pdf?src-supplier=TME; ComponentLink16URL: https://sigma.octopart.com:443/150570891/technical_drawing/Panasonic-ETQP5M470YFM.pdf?src-supplier=Panasonic+SCT; ComponentLink16Description: https://sigma.octopart.com:443/150570891/technical_drawing/Panasonic-ETQP5M470YFM.pdf?src-supplier=Panasonic+SCT; ComponentLink17URL: https://datasheet.octopart.com:443/ETQ-P5M470YFM-Panasonic-datasheet-31830631.pdf?src-supplier=Electro+Sonic; ComponentLink17Description: https://datasheet.octopart.com:443/ETQ-P5M470YFM-Panasonic-datasheet-31830631.pdf?src-supplier=Electro+Sonic; Inductance: 48µH
Q1 = NVTFS5C680NLTAG: Single N-Channel Power MOSFET 60V, 20A, 26.5mΩ 1500 / Tape & Reel; Manufacturer: onsemi; Manufacturer Lifecycle Status: ACTIVE; Continuous Drain Current (ID): 7.82A; Drain to Source Resistance: 42.5mΩ; Gate to Source Voltage (Vgs): 20V; Max Junction Temperature (Tj): 175°C; Number of Channels: 1; Power Dissipation: 3W; Turn-Off Delay Time: 13ns; Turn-On Delay Time: 6.5ns; Supplier 1: DigiKey; Supplier Part Number 1: NVTFS5C680NLTAGOSCT-ND; Supplier: DigiKey; Supplier Part Number: NVTFS5C680NLTAGOSCT-ND; Manufacturer Part Number: NVTFS5C680NLTAG; RoHS: Compliant; Category: MOSFETs; Stock: 6169; Pricing: 1=1,18, 10=0,765, 100=0,5641, 500=0,44842 (USD); China RoHS: Non-Compliant; Drain to Source Breakdown Voltage: 60V; Drain to Source Voltage (Vdss): 60V; Height: 800µm; Lifecycle Status: Production; Max Operating Temperature: 175°C; Min Breakdown Voltage: 60V; Min Operating Temperature: -55°C; Number of Elements: 1; Number of Terminals: 5; REACH SVHC: No; Schedule B: 8541290080; ComponentLink1URL: https://datasheet.octopart.com:443/NVTFS5C680NLTAG-onsemi-datasheet-156001634.pdf?src-supplier=IHS; ComponentLink1Description: https://datasheet.octopart.com:443/NVTFS5C680NLTAG-onsemi-datasheet-156001634.pdf?src-supplier=IHS; ComponentLink2URL: https://sigma.octopart.com:443/138898242/technical_drawing/onsemi-NVTFS5C680NLTAG.pdf?src-supplier=Upverter; ComponentLink2Description: https://sigma.octopart.com:443/138898242/technical_drawing/onsemi-NVTFS5C680NLTAG.pdf?src-supplier=Upverter; ComponentLink3URL: https://datasheet.octopart.com:443/NVTFS5C680NLTAG-ON-Semiconductor-datasheet-139013615.pdf?src-supplier=Electro+Sonic; ComponentLink3Description: https://datasheet.octopart.com:443/NVTFS5C680NLTAG-ON-Semiconductor-datasheet-139013615.pdf?src-supplier=Electro+Sonic; ComponentLink4URL: https://datasheet.octopart.com:443/NVTFS5C680NLTAG-ON-Semiconductor-datasheet-68307394.pdf?src-supplier=onsemi; ComponentLink4Description: https://datasheet.octopart.com:443/NVTFS5C680NLTAG-ON-Semiconductor-datasheet-68307394.pdf?src-supplier=onsemi; ComponentLink5URL: http://sigma.octopart.com:80/150630591/rohs_statement/ON-Semiconductor-NVTFS5C680NLTAG.pdf?src-supplier=Compliance+Statements; ComponentLink5Description: http://sigma.octopart.com:80/150630591/rohs_statement/ON-Semiconductor-NVTFS5C680NLTAG.pdf?src-supplier=Compliance+Statements; ComponentLink6URL: http://sigma.octopart.com:80/reach_statement/ON-Semiconductor-company-79.pdf?src-supplier=Compliance+Statements; ComponentLink6Description: http://sigma.octopart.com:80/reach_statement/ON-Semiconductor-company-79.pdf?src-supplier=Compliance+Statements; ComponentLink7URL: https://octopart.com:443/opatz8j6/c1?t=ArcHL9UVBtlnzVgGHBfE7a_h9s1YCUtyd8EDdrHC2PTUW_HO2F9quOn9Y5qfsPY5s_Zyk4nkk7QJz5arH-e3I-c2JgQX-GlOuwlXsGSnoa6izDJP0gTMAvJ8KuOelPQbjo9v-EU_jN9aE1yl8YbPbWwLo9E9kCztZ3rs5Vyvwbjj-VOdYIXD0ftJl_GLyja-EMH9toYYVXBKtPNt2Lro4vR8BXDVQfe8Ht8DVJ2QjP2pCJLbDj8K3xepgBTNK6OdPZyth80JI6fQIq3nxLqte9py_zn8nzyBerFRCf-pzXU6IvNc9lywlFQuURd4V-3OjG2V8Rdw4KbLbxH9GkL7AtSek62PVATgeyEUN7Kc7PnaZg&src-supplier=Compliance+Statements; ComponentLink7Description: https://octopart.com:443/opatz8j6/c1?t=ArcHL9UVBtlnzVgGHBfE7a_h9s1YCUtyd8EDdrHC2PTUW_HO2F9quOn9Y5qfsPY5s_Zyk4nkk7QJz5arH-e3I-c2JgQX-GlOuwlXsGSnoa6izDJP0gTMAvJ8KuOelPQbjo9v-EU_jN9aE1yl8YbPbWwLo9E9kCztZ3rs5Vyvwbjj-VOdYIXD0ftJl_GLyja-EMH9toYYVXBKtPNt2Lro4vR8BXDVQfe8Ht8DVJ2QjP2pCJLbDj8K3xepgBTNK6OdPZyth80JI6fQIq3nxLqte9py_zn8nzyBerFRCf-pzXU6IvNc9lywlFQuURd4V-3OjG2V8Rdw4KbLbxH9GkL7AtSek62PVATgeyEUN7Kc7PnaZg&src-supplier=Compliance+Statements; ComponentLink8URL: https://octopart.com:443/opatz8j6/c1?t=h028ATufzzsJULRA869P7SZdp-Wpt_KrC2RqInijH6hskcWW-EmMUlj6YmKXcR85Vsly7Dd6lRvBMnUsxBjqw7HuW468MJPRVMESG6AfSRrF3fc7wNxoHbnHWYy9p2S6yWE15ZT_C0ePY1I1Pr14F-IoE6e51Hjtjgr99Pia2upkj5Jfun9iC7CH3qbYtMOLk3beEKJxRaW3SuxADs7wRVUmiQJqOo6xhMZPamc0Oi3UyJXbS9Rbe3KTkBNR1sUivbaF_XMKqIelNr3QkLPL63EEAlWLzFVl9DhtTJXBY2-FGDPyIlfr2SKAZRmrwAymqeP9bpEpz5eT7QN5mmgp67ypEV-l3fKOUDoZ6FfOr0nO474&src-supplier=Compliance+Statements; ComponentLink8Description: https://octopart.com:443/opatz8j6/c1?t=h028ATufzzsJULRA869P7SZdp-Wpt_KrC2RqInijH6hskcWW-EmMUlj6YmKXcR85Vsly7Dd6lRvBMnUsxBjqw7HuW468MJPRVMESG6AfSRrF3fc7wNxoHbnHWYy9p2S6yWE15ZT_C0ePY1I1Pr14F-IoE6e51Hjtjgr99Pia2upkj5Jfun9iC7CH3qbYtMOLk3beEKJxRaW3SuxADs7wRVUmiQJqOo6xhMZPamc0Oi3UyJXbS9Rbe3KTkBNR1sUivbaF_XMKqIelNr3QkLPL63EEAlWLzFVl9DhtTJXBY2-FGDPyIlfr2SKAZRmrwAymqeP9bpEpz5eT7QN5mmgp67ypEV-l3fKOUDoZ6FfOr0nO474&src-supplier=Compliance+Statements
R36 R40 R43 R108 R111 = RES0402-30k-1%: 0402 30K Ohms 1% High Power Thick Film Surface Mount Chip Resistor; Manufacturer: Vishay; Manufacturer Part Number: CRCW040230K0FKEDHP; Manufacturer Package Identifier: CRCW0402-HPe3; Resistance: 30kΩ; Max Power Dissipation: 125mW; Power Dissipation: 200mW; Value: 30kΩ; Temperature Coefficient: 100ppm/°C; Voltage Rating: 50V; Supplier 1: DigiKey; Supplier Part Number 1: CRCW040230K0FKEDHPCT-ND; Supplier: DigiKey; Supplier Part Number: CRCW040230K0FKEDHPCT-ND; RoHS: Compliant; Category: Chip SMD Resistors; Stock: 9449; Pricing: 1=0,13, 10=0,061, 25=0,0472, 50=0,0392, 100=0,0331, 250=0,027, 500=0,0235, 1000=0,02072, 5000=0,01631 (USD); Case/Package: 0402; Case Code (Imperial): 0402; Case Code (Metric): 1005; China RoHS: Non-Compliant; Composition: Thick Film; Contact Plating: Tin; Features: Automotive AEC-Q200; Height: 300µm; Lead Free: Lead Free; Length: 990.6µm; Lifecycle Status: Production; Max Operating Temperature: 155°C; Min Operating Temperature: -55°C; Mounting Technology: Surface Mount; Number of Terminals: 2; Number of Terminations: 2; Packaging: Digi-Reel®; Power Rating: 200mW; Radiation Hardening: No; REACH SVHC: Yes; Tolerance: 1%; Width: 500µm; Working Voltage: 50V; ComponentLink1URL: https://datasheet.octopart.com/CRCW040230K0FKEDHP-Vishay-datasheet-83567917.pdf; ComponentLink1Description: https://datasheet.octopart.com/CRCW040230K0FKEDHP-Vishay-datasheet-83567917.pdf; ComponentLink2URL: https://datasheet.octopart.com/D-CRCW-e3-Standard-Thick-Film-Chip-Resistors-Vishay-datasheet-family-64.pdf; ComponentLink2Description: https://datasheet.octopart.com/D-CRCW-e3-Standard-Thick-Film-Chip-Resistors-Vishay-datasheet-family-64.pdf; ComponentLink3URL: https://datasheet.octopart.com:443/CRCW040230K0FKEDHP-Vishay-datasheet-137113427.pdf?src-supplier=X-ON; ComponentLink3Description: https://datasheet.octopart.com:443/CRCW040230K0FKEDHP-Vishay-datasheet-137113427.pdf?src-supplier=X-ON; ComponentLink4URL: https://datasheet.octopart.com:443/CRCW040230K0FKEDHP-Vishay-datasheet-62316122.pdf?src-supplier=Future+Electronics; ComponentLink4Description: https://datasheet.octopart.com:443/CRCW040230K0FKEDHP-Vishay-datasheet-62316122.pdf?src-supplier=Future+Electronics; ComponentLink5URL: http://sigma.octopart.com:80/rohs_certificate/D-CRCW-e3-Standard-Thick-Film-Chip-Resistors-Vishay-family-102.pdf?src-supplier=Compliance+Statements; ComponentLink5Description: http://sigma.octopart.com:80/rohs_certificate/D-CRCW-e3-Standard-Thick-Film-Chip-Resistors-Vishay-family-102.pdf?src-supplier=Compliance+Statements
R37 R44 = RES0402-1k-1%: Res Thick Film 0402 1K Ohm 1% 0.063W(1/16W) ±50ppm/C Pad SMD Automotive T/R; Manufacturer: Vishay; Manufacturer Part Number: CRCW04021K00FHEDP; Resistance: 1kΩ; Max Power Dissipation: 63mW; Value: 1kΩ; Temperature Coefficient: 50ppm/°C; Voltage Rating: 50V; Supplier 1: DigiKey; Supplier Part Number 1: CRCW04021K00FHEDP-ND; Supplier: DigiKey; Supplier Part Number: CRCW04021K00FHEDP-ND; RoHS: Compliant; Category: Chip SMD Resistors; Pricing: 10000=0,03252 (USD); Case/Package: 0402; China RoHS: Non-Compliant; Composition: Thick Film; Contact Plating: Tin; Depth: 500µm; Features: Automotive AEC-Q200; Height: 350µm; Length: 990.6µm; Lifecycle Status: Production; Max Operating Temperature: 155°C; Military Standard: Not; Min Operating Temperature: -55°C; Mounting Technology: Surface Mount; Number of Terminals: 2; Number of Terminations: 2; Packaging: Tape & Reel; Power Dissipation: 63mW; Power Rating: 63mW; Radiation Hardening: No; REACH SVHC: Yes; Tolerance: 1%; Width: 500µm; Working Voltage: 50V; ComponentLink1URL: https://datasheet.octopart.com:443/CRCW04021K00FHEDP-Vishay-datasheet-182027415.pdf?src-supplier=IHS; ComponentLink1Description: https://datasheet.octopart.com:443/CRCW04021K00FHEDP-Vishay-datasheet-182027415.pdf?src-supplier=IHS; ComponentLink2URL: https://datasheet.octopart.com:443/CRCW04021K00FHEDP-Vishay-Dale-datasheet-141207190.pdf?src-supplier=Upverter; ComponentLink2Description: https://datasheet.octopart.com:443/CRCW04021K00FHEDP-Vishay-Dale-datasheet-141207190.pdf?src-supplier=Upverter; ComponentLink3URL: http://sigma.octopart.com:80/rohs_statement/Vishay-company-15.pdf?src-supplier=Compliance+Statements; ComponentLink3Description: http://sigma.octopart.com:80/rohs_statement/Vishay-company-15.pdf?src-supplier=Compliance+Statements